# Altium project iot-vehicle-tracking-system-main.PrjPcb
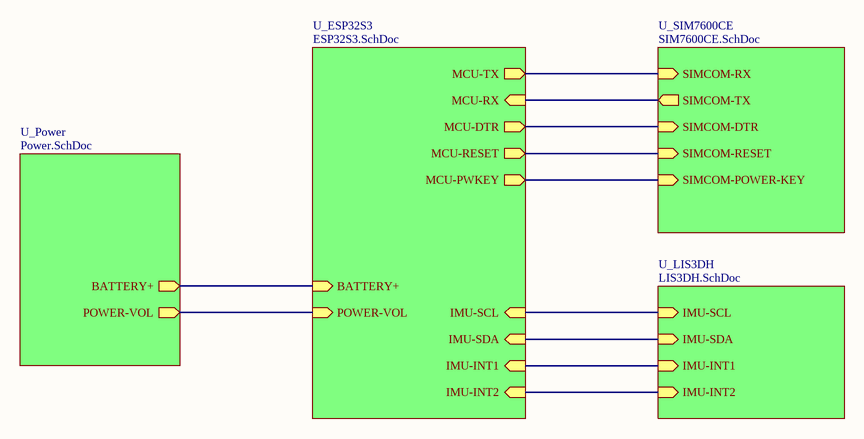
[diagram p0: Main-Schematic.SchDoc]
5 sheets, 174 parts. Net scope: hierarchical (ports join the sheet entries above them; power ports are global).
Board file: Main.PcbDoc
Sheets:
  Main-Schematic.SchDoc
    U_Power = Power.SchDoc
    U_ESP32S3 = ESP32S3.SchDoc
    U_SIM7600CE = SIM7600CE.SchDoc
    U_LIS3DH = LIS3DH.SchDoc

## Sheet Main-Schematic.SchDoc
size A; SheetNumber: 1; SheetTotal: 5

### Sub-sheets
U_ESP32S3 = ESP32S3.SchDoc: MCU-TX (out), MCU-RX (in), MCU-PWKEY (out), MCU-RESET (out), BATTERY+ (in), IMU-SCL (in), IMU-SDA (in), IMU-INT1 (in), IMU-INT2 (in), POWER-VOL (in), MCU-DTR (out)
U_LIS3DH = LIS3DH.SchDoc: IMU-SCL (in), IMU-SDA (in), IMU-INT1 (in), IMU-INT2 (in)
U_Power = Power.SchDoc: BATTERY+ (out), POWER-VOL (out)
U_SIM7600CE = SIM7600CE.SchDoc: SIMCOM-TX (out), SIMCOM-RX (in), SIMCOM-POWER-KEY (in), SIMCOM-RESET (in), SIMCOM-DTR (in)

### Nets
I2C0-SCL: sheet U_ESP32S3/IMU-SCL, sheet U_LIS3DH/IMU-SCL
I2C0-SDA: sheet U_ESP32S3/IMU-SDA, sheet U_LIS3DH/IMU-SDA
NetC54_1: sheet U_ESP32S3/MCU-RX, sheet U_SIM7600CE/SIMCOM-TX
NetQ1_3: sheet U_ESP32S3/MCU-DTR, sheet U_SIM7600CE/SIMCOM-DTR
NetQ2_3: sheet U_ESP32S3/MCU-TX, sheet U_SIM7600CE/SIMCOM-RX
NetR8_2: sheet U_Power/POWER-VOL, sheet U_ESP32S3/POWER-VOL
NetR10_2: sheet U_Power/BATTERY+, sheet U_ESP32S3/BATTERY+
NetR56_1: sheet U_ESP32S3/MCU-RESET, sheet U_SIM7600CE/SIMCOM-RESET
NetR57_1: sheet U_ESP32S3/MCU-PWKEY, sheet U_SIM7600CE/SIMCOM-POWER-KEY
NetU6_41: sheet U_ESP32S3/IMU-INT1, sheet U_LIS3DH/IMU-INT1
NetU6_42: sheet U_ESP32S3/IMU-INT2, sheet U_LIS3DH/IMU-INT2

## Sheet Power.SchDoc
size A3; SheetNumber: 2; SheetTotal: 5
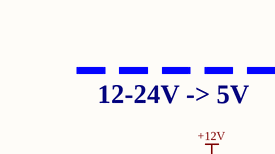
[diagram p1: Power.SchDoc, top left]
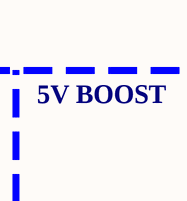
[diagram p2: Power.SchDoc, top right]
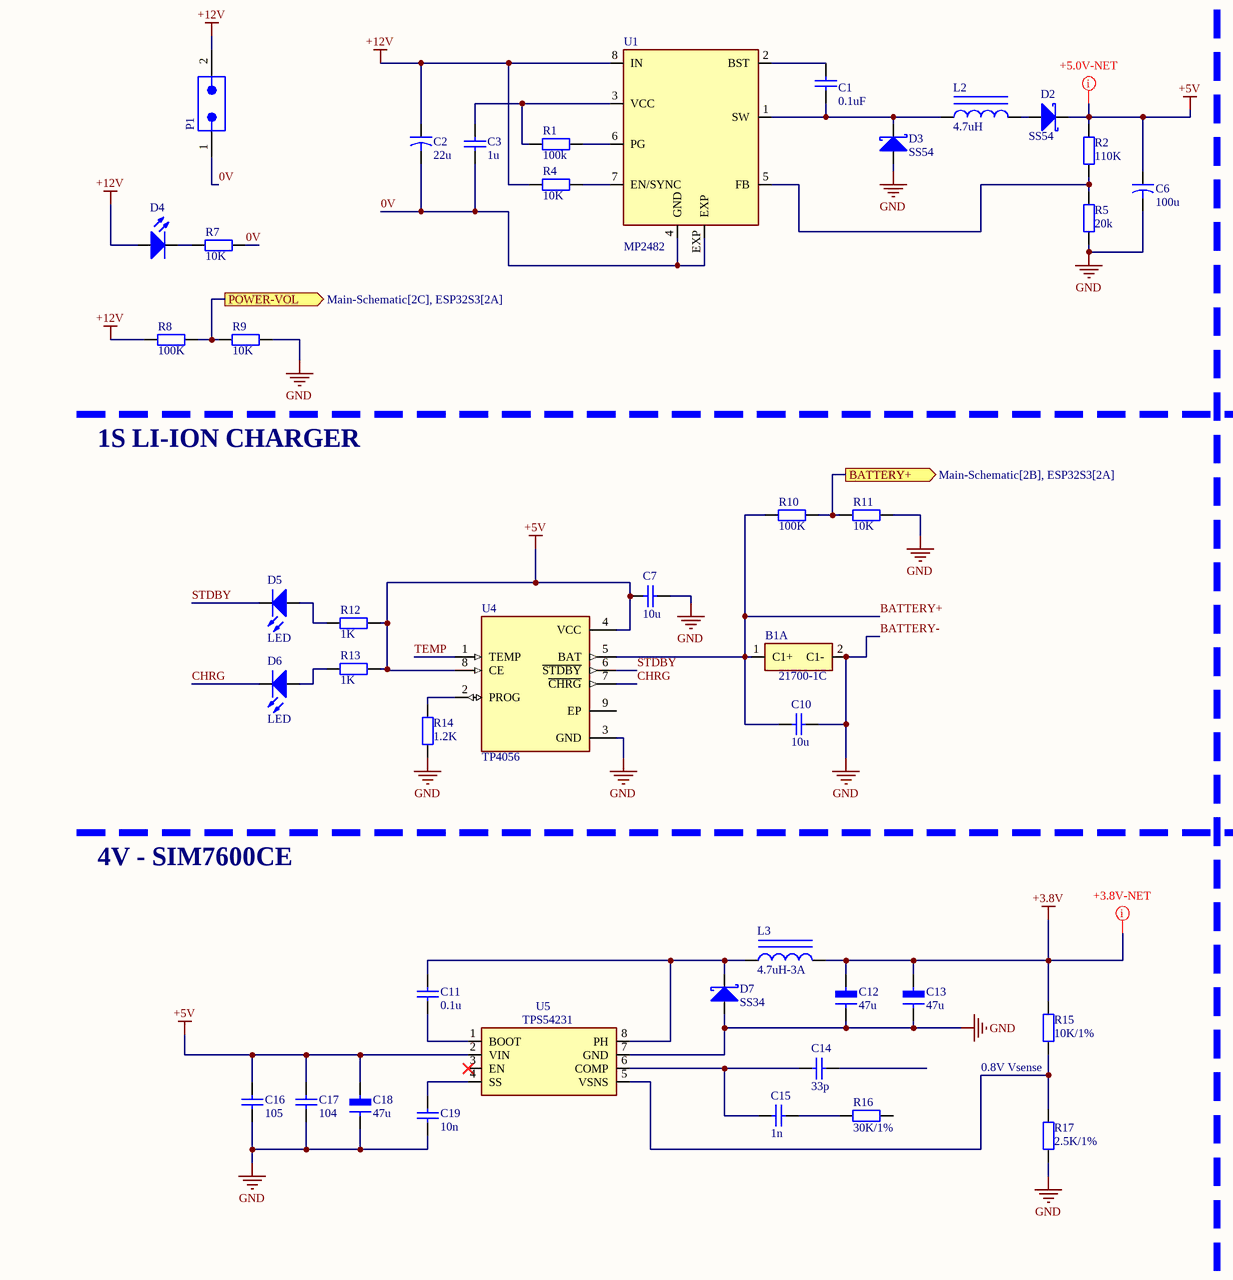
[diagram p3: Power.SchDoc, bottom left]
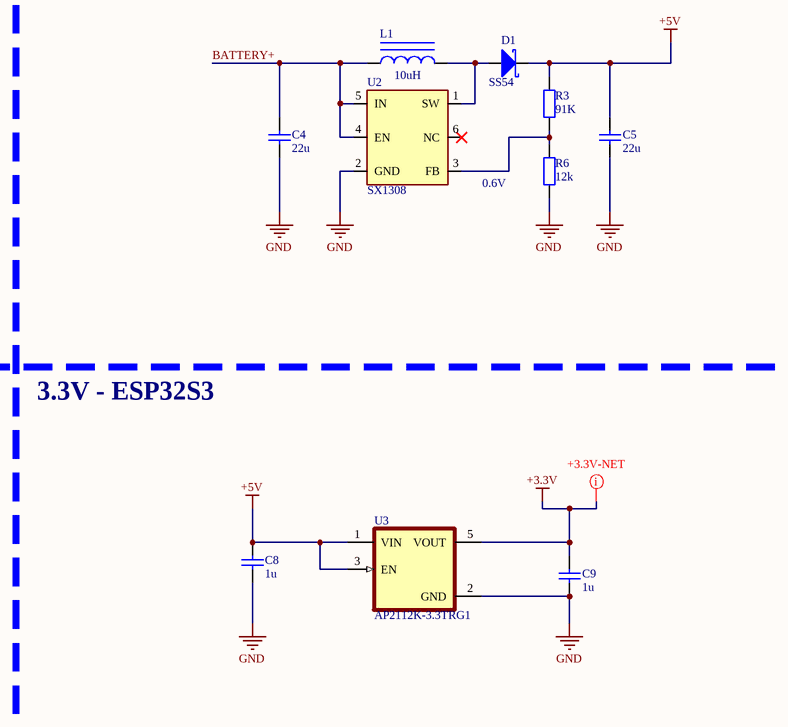
[diagram p4: Power.SchDoc, bottom right]

### Parts
B1  21700-1C  [18650-2C]  (part A of 2)
C1  0.1uF  [CAP_1206]
C2  22u  [ALU-SMD-CAP-D-6.3mm]
C3  1u  [CAP_0603]
C4  22u  [CAP_0603]
C5  22u  [CAP_0603]
C6  100u  [ALU-SMD-CAP-D-6.3mm]
C7  10u  [CAP_0603]
C8  1u  [CAP_0603]
C9  1u  [CAP_0603]
C10  10u  [CAP_0603]
C11  0.1u  [CAP_0603]
C12  47u  [C_Tanta_C6032]
C13  47u  [C_Tanta_C6032]
C14  33p  [CAP_0603]
C15  1n  [CAP_0603]
C16  105  [CAP_0603]
C17  104  [CAP_0603]
C18  47u  [C_Tanta_C6032]
C19  10n  [CAP_0603]
D1  SS54  [SMB]
D2  SS54  [SMB]
D3  SS54  [SMB]
D4  (no value)  [LED-0805-Red]
D5  LED  [LED-0805-Red]
D6  LED  [LED-0805-Red]
D7  SS34  [SMA]
L1  10uH  [CD75]
L2  4.7uH  [IND-0520]
L3  4.7uH-3A  [IND_CDRH127-4R7NC_SUM]
P1  64900229522  [64900229522]  (value not drawn)
R1  100k  [RES_0603]
R2  110K  [RES_0603]
R3  91K  [RES_0603]
R4  10K  [RES_0603]
R5  20k  [RES_0603]
R6  12k  [RES_0603]
R7  10K  [RES_0603]
R8  100K  [RES_0603]
R9  10K  [RES_0603]
R10  100K  [RES_0603]
R11  10K  [RES_0603]
R12  1K  [RES_0603]
R13  1K  [RES_0603]
R14  1.2K  [RES_0603]
R15  10K/1%  [RES_0603]
R16  30K/1%  [RES_0603]
R17  2.5K/1%  [RES_0603]
U1  MP2482  [SOP8-P]
U2  SX1308  [SOT23-6]
U3  AP2112K-3.3TRG1  [SOT95P285X140-5N]
U4  TP4056  [SOP127P600X175-9N]
U5  TPS54231  [SOIC8-1.75H]

### Ports
BATTERY+ (out, see Main-Schematic[2B], ESP32S3[2A]), POWER-VOL (out, see Main-Schematic[2C], ESP32S3[2A])

### Nets
+3.3V: C9.2 U3.5(VOUT)  [project net V-MCU]
+3.8V: C12.1 C13.1 L3.2 R15.2  [project net V-SIM]
+5V: C5.2 C6.1 C7.2 C8.2 C16.2 C17.2 C18.1 D1.2(K) D2.2(K) R2.2 R3.2 R12.2 R13.2 U3.1(VIN) U3.3(EN) U4.4(VCC) U4.8(CE) U5.2(VIN)
+12V: C2.1 D4.1(A) P1.2 R4.2 R8.1 U1.8(IN)
BATTERY-: B1.2(C1-) C4.1 C5.1 C6.2 C7.1 C8.1 C9.1 C10.1 C12.2 C13.2 C16.1 C17.1 C18.2 C19.1 D3.1(A) D7.1(A) R5.1 R6.1 R9.2 R11.2 R14.2 R17.1 U2.2(GND) U3.2(GND) U4.3(GND) U5.7(GND)  [also labelled GND]
0V: C2.2 C3.1 P1.1 R7.2 U1.4(GND) U1.EXP
BATTERY+: B1.1(C1+) C4.2 C10.2 L1.1 R10.1 U2.4(EN) U2.5(IN) U4.5(BAT)
CHRG: D6.2(K) U4.7(~{CHRG})
STDBY: D5.2(K) U4.6(~{STDBY})
TEMP: U4.1(TEMP)
NetC1_1: C1.1 U1.2(BST)
NetC1_2: C1.2 D3.2(K) L2.1 U1.1(SW)
NetC3_2: C3.2 R1.2 U1.3(VCC)
NetC11_1: C11.1 U5.1(BOOT)
NetC11_2: C11.2 D7.2(K) L3.1 U5.8(PH)
NetC14_2: C14.2 C15.2 U5.6(COMP)
NetC15_1: C15.1 R16.2
NetC19_2: C19.2 U5.4(SS)
NetD1_1: D1.1(A) L1.2 U2.1(SW)
NetD2_1: D2.1(A) L2.2
NetD4_2: D4.2(K) R7.1
NetD5_1: D5.1(A) R12.1
NetD6_1: D6.1(A) R13.1
NetR1_1: R1.1 U1.6(PG)
NetR2_1: R2.1 R5.2 U1.5(FB)
NetR3_1: R3.1 R6.2 U2.3(FB)
NetR4_1: R4.1 U1.7(EN/SYNC)
NetR8_2: R8.2 R9.1 ; port POWER-VOL
NetR10_2: R10.2 R11.1 ; port BATTERY+
NetR14_1: R14.1 U4.2(PROG)
NetR15_1: R15.1 R17.2 U5.5(VSNS)

Not connected (* = marked no-connect by the designer): C14 1; R16 1; U2 6(NC)*; U4 9(EP); U5 3(EN)*

### Layout directives
net class POWER: +5V, V-MCU, V-SIM

### Notes on the sheet
- 12-24V -> 5V
- 5V BOOST
- 0.6V
- 1S LI-ION CHARGER
- 3.3V - ESP32S3
- 4V - SIM7600CE
- (near R15) 0.8V Vsense

### Library data of the parts
B1 = 18650-2C
C1 C3-C5 C7-C11 C14-C17 C19 = Cap_NP: Non-polarized capacitor
C2 C6 = Cap_Alu: Polarized aluminum capacitor
C12 C13 C18 = Cap_Tatan: Polarized tantaLum capacitor
D1-D3 D7 = S-Diode: Schottky diode
D4-D6 = LED: Light Emitting Diode
L1-L3 = Inductor Iron: Magnetic-Core Inductor; Published: 24-Mar-1999; LatestRevisionDate: 17-Jul-2002; LatestRevisionNote: Re-released for DXP Platform.; PackageReference: AXIAL-0.9; Publisher: Altium Limited; PackageDescription: Axial Device, Thru-Hole; 2 Leads; 0.9 in Pin Spacing
P1 = 64900229522: WR-MPC4 THT Male Right Angled Header, pitch 4.2mm, 2p; Manufacturer: Wurth Elektronik; Contact Resistance: 10mOhm; Insulation Resistance: 1000MOhm; Rated Current: 9A; Working Voltage: 600VAC; Manufacturer Part Number: 64900229522; Category: Wire-to-Board Connectors; Match Code: WR-MPC4; ComponentLink1Description: Website Link; ComponentLink1URL: https://www.we-online.com/redexpert/article/64900229522?ad; ComponentLink2Description: Datasheet Link; ComponentLink2URL: https://www.we-online.com/redexpert/spec/64900229522?ad; Mount: Through Hole; Min Operating Temperature: -40°C; Max Operating Temperature: 105°C; Packaging: Tray; Gender: Male; Number of Pins: 2; Number of Rows: 2; Orientation: Right Angled; Pitch: 4.2mm
R1-R17 = Resistor
U1 = MP2482: 5A, 30V, 420kHz Step-Down Converter; MF: Monolithic Power Systems Inc.; SnapEDA_Link: https://www.snapeda.com/parts/MP2482/Monolithic+Power+Systems+Inc./view-part/?ref=snap; Package: None; Value: *; MP: MP2482; Check_prices: https://www.snapeda.com/parts/MP2482/Monolithic+Power+Systems+Inc./view-part/?ref=eda
U2 = SX1308: 1.2MHz 2A Step Up Converter 85T
U3 = AP2112K-3.3TRG1: Linear Voltage Regulator IC Positive Fixed 1 Output 600mA SOT-25; MF: Diodes Inc.; Value: *; Purchase-URL: https://pricing.snapeda.com/search/part/AP2112K-3.3TRG1/?ref=eda; Package: SOT-753 Diodes Inc.; Availability: In Stock; Check_prices: https://www.snapeda.com/parts/AP2112K-3.3TRG1/Diodes+Inc./view-part/?ref=eda; Price: None; SnapEDA_Link: https://www.snapeda.com/parts/AP2112K-3.3TRG1/Diodes+Inc./view-part/?ref=snap; MP: AP2112K-3.3TRG1
U4 = TP4056: Complete single cell Li-Ion battery with a constant current / constant voltage linear charger; MF: NanJing Top Power ASIC Corp.; Check_prices: https://www.snapeda.com/parts/TP4056/NanJing+Top+Power+ASIC+Corp./view-part/?ref=eda; SnapEDA_Link: https://www.snapeda.com/parts/TP4056/NanJing+Top+Power+ASIC+Corp./view-part/?ref=snap; Price: None; Availability: Not in stock; Package: Package; MP: TP4056; Value: *
U5 = TPS54231: 2-A, 28-V Input, Step-Down DC-DC Converter

## Sheet ESP32S3.SchDoc
size A3; SheetNumber: 3; SheetTotal: 5
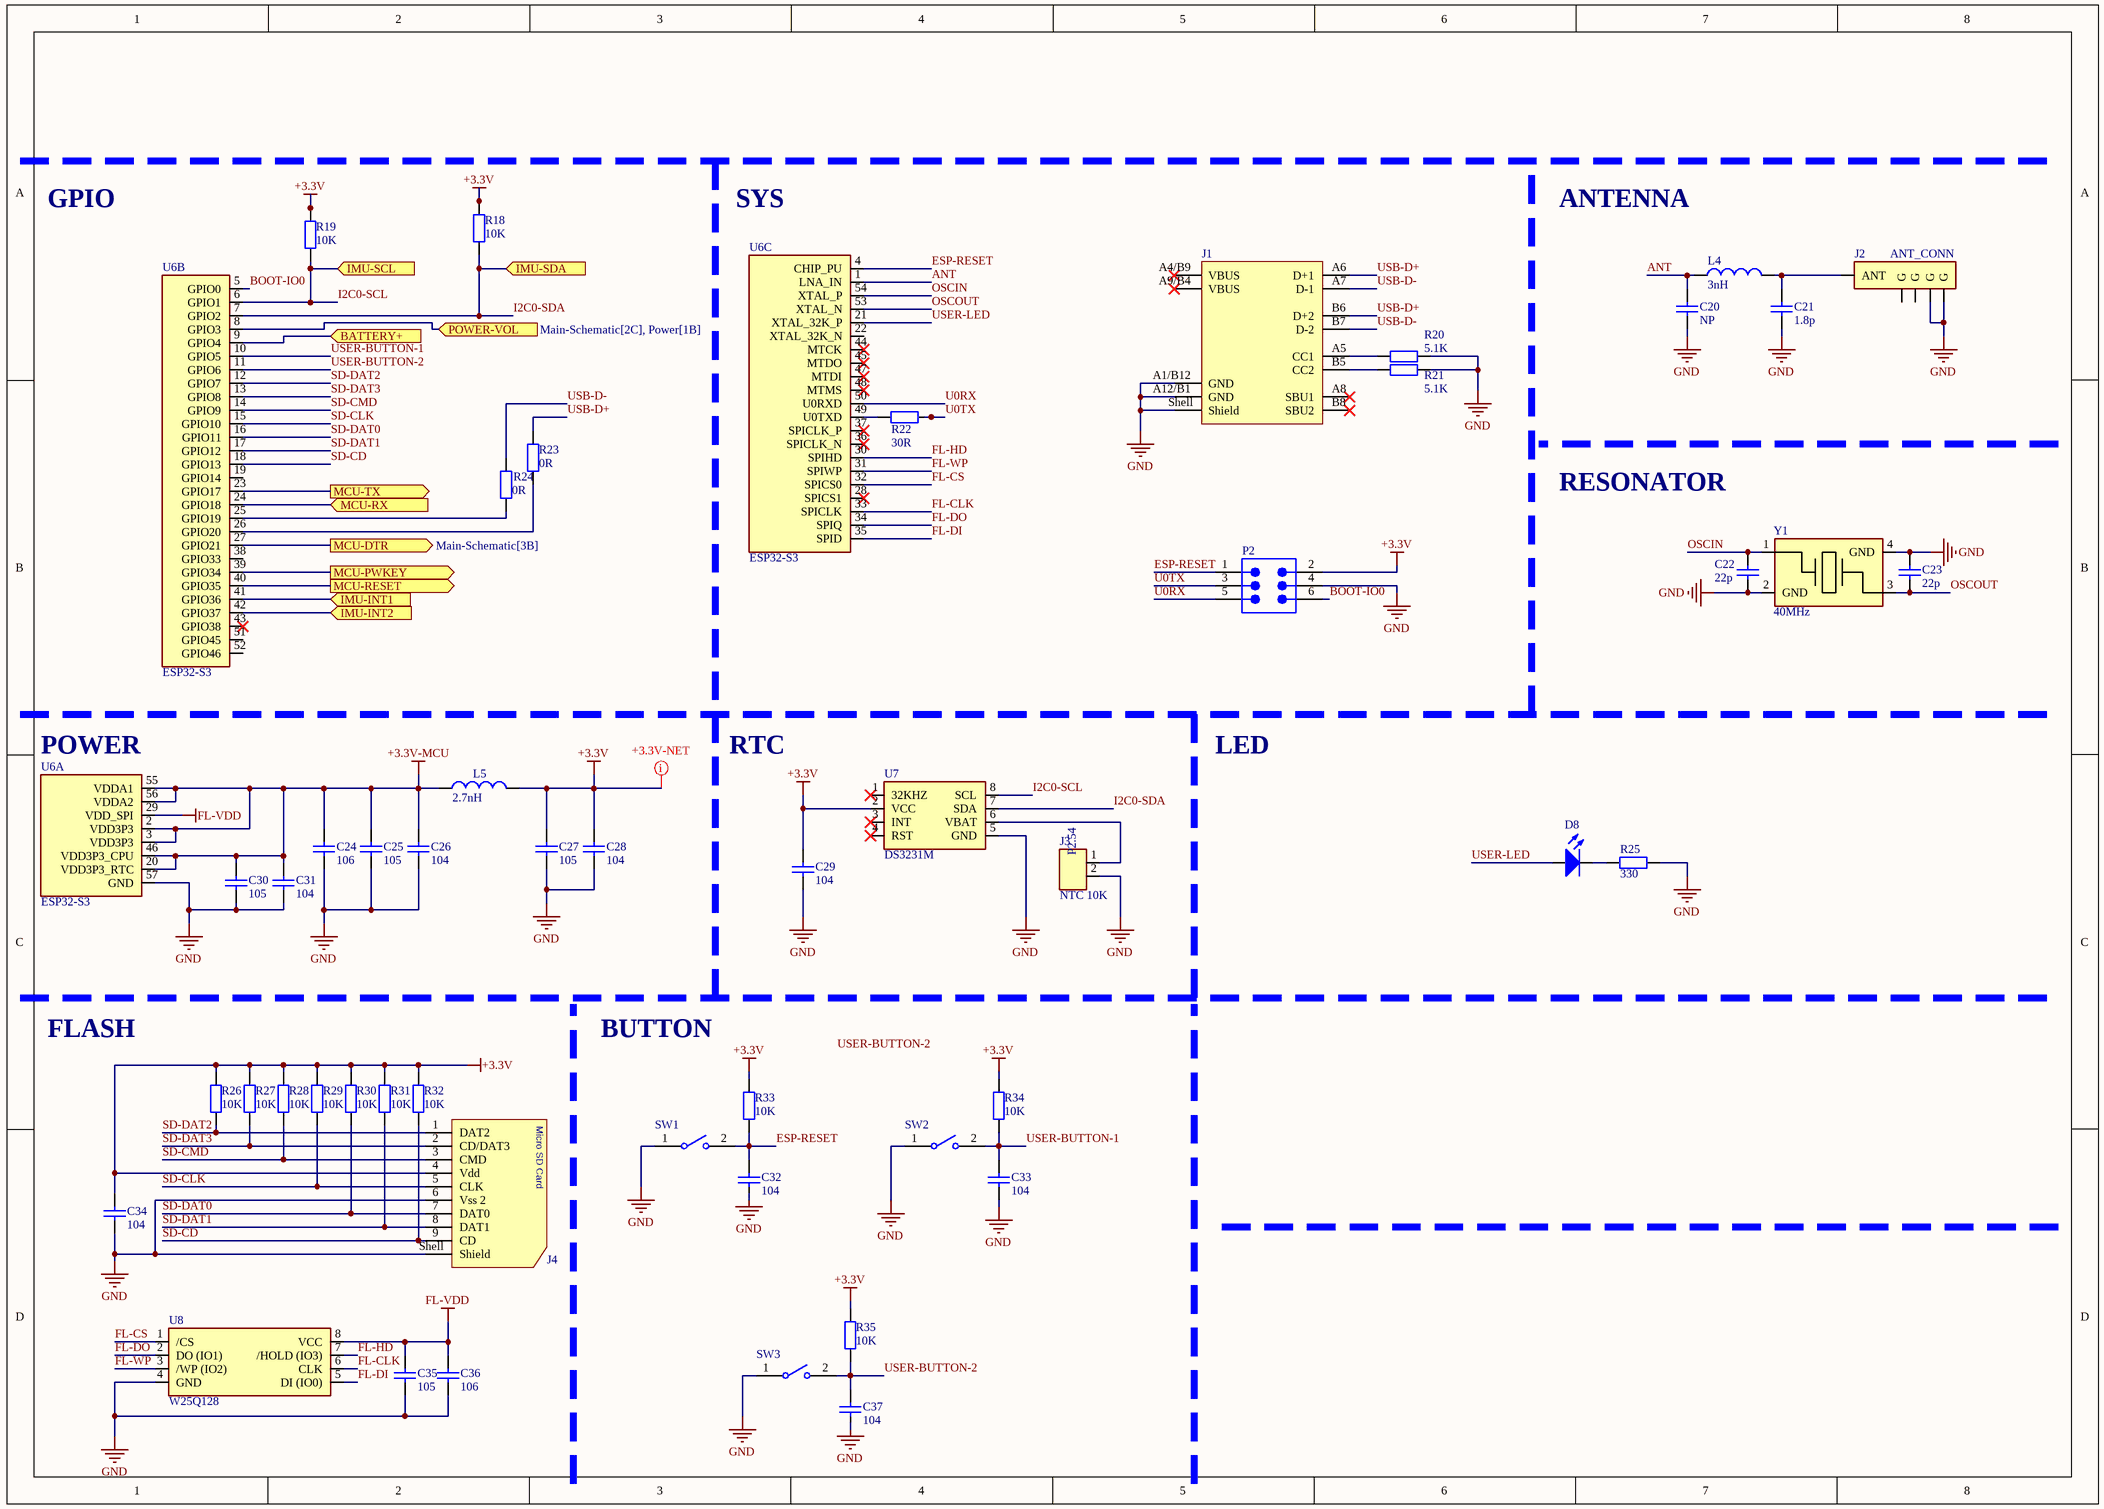
[diagram p5: ESP32S3.SchDoc]

### Parts
C20  NP  [CAP_0603]
C21  1.8p  [CAP_0603]
C22  22p  [CAP_0603]
C23  22p  [CAP_0603]
C24  106  [CAP_0603]
C25  105  [CAP_0603]
C26  104  [CAP_0603]
C27  105  [CAP_0603]
C28  104  [CAP_0603]
C29  104  [CAP_0603]
C30  105  [CAP_0603]
C31  104  [CAP_0603]
C32  104  [CAP_0603]
C33  104  [CAP_0603]
C34  104  [CAP_0603]
C35  105  [CAP_0603]
C36  106  [CAP_0603]
C37  104  [CAP_0603]
D8  (no value)  [LED-0805-Red]
J1  629722000214  [629722000214]  (value not drawn)
J2  ANT_CONN  [IPEX]
J3  NTC 10K  [XH2.54M-2]
J4  693071040911  [693071040911]  (value not drawn)
L4  3nH  [INDC-0805]
L5  2.7nH  [INDC-0805]
P2  61200621621  [61200621621]  (value not drawn)
R18  10K  [RES_0603]
R19  10K  [RES_0603]
R20  5.1K  [RES_0603]
R21  5.1K  [RES_0603]
R22  30R  [RES_0603]
R23  0R  [RES_0603]
R24  0R  [RES_0603]
R25  330  [RES_0603]
R26  10K  [RES_0603]
R27  10K  [RES_0603]
R28  10K  [RES_0603]
R29  10K  [RES_0603]
R30  10K  [RES_0603]
R31  10K  [RES_0603]
R32  10K  [RES_0603]
R33  10K  [RES_0603]
R34  10K  [RES_0603]
R35  10K  [RES_0603]
SW1  434121050816  [434121050816]  (value not drawn)
SW2  434121050816  [434121050816]  (value not drawn)
SW3  434121050816  [434121050816]  (value not drawn)
U6  ESP32-S3  [QFN56]  (parts A,B,C of 3)
U7  DS3231M  [SOP8-P1.27]
U8  W25Q128  [SOIC127P790X216-8N]
Y1  40MHz  [Y-3225]

### Ports
BATTERY+ (in, see Main-Schematic[2B], Power[4B]), IMU-INT1 (in, see Main-Schematic[3C], LIS3DH[3B]), IMU-INT2 (in, see Main-Schematic[3C], LIS3DH[3B]), IMU-SCL (in, see Main-Schematic[3C], LIS3DH[2C]), IMU-SDA (in, see Main-Schematic[3C], LIS3DH[2C]), MCU-DTR (out, see Main-Schematic[3B]), MCU-PWKEY (out, see Main-Schematic[3B]), MCU-RESET (out, see Main-Schematic[3B]), MCU-RX (in, see Main-Schematic[3B]), MCU-TX (out, see Main-Schematic[3B]), POWER-VOL (in, see Main-Schematic[2C], Power[1B])

### Nets
+3.3V: C27.2 C28.2 C29.1 C34.2 J4.4(Vdd) L5.2 P2.2 R18.2 R19.2 R26.2 R27.2 R28.2 R29.2 R30.2 R31.2 R32.2 R33.2 R34.2 R35.2 U7.2(VCC)  [project net V-MCU]
+3.3V-MCU: C24.2 C25.2 C26.2 C30.2 C31.2 L5.1 U6.2(VDD3P3) U6.3(VDD3P3) U6.20(VDD3P3_RTC) U6.46(VDD3P3_CPU) U6.55(VDDA1) U6.56(VDDA2)
FL-VDD: C35.2 C36.2 U6.29(VDD_SPI) U8.8(VCC)
GND: C20.1 C21.1 C22.1 C23.2 C24.1 C25.1 C26.1 C27.1 C28.1 C29.2 C30.1 C31.1 C32.2 C33.2 C34.1 C35.1 C36.1 C37.2 J1.A1/B12(GND) J1.A12/B1(GND) J1.Shell(Shield) J2.4(G) J2.5(G) J3.2 J4.6(Vss_2) J4.Shell(Shield) P2.4 R20.2 R21.2 R25.2 SW1.1 SW2.1 SW3.1 U6.57(GND) U7.5(GND) U8.4(GND) Y1.2(GND) Y1.4(GND)  [project net BATTERY-]
ANT: C20.2 L4.1 U6.1(LNA_IN)
BOOT-IO0: P2.6 U6.5(GPIO0)
ESP-RESET: C32.1 P2.1 R33.1 SW1.2 U6.4(CHIP_PU)
FL-CLK: U6.33(SPICLK) U8.6(CLK)
FL-CS: U6.32(SPICS0) U8.1(/CS)
FL-DI: U6.35(SPID) U8.5(DI_(IO0))
FL-DO: U6.34(SPIQ) U8.2(DO_(IO1))
FL-HD: U6.30(SPIHD) U8.7(/HOLD_(IO3))
FL-WP: U6.31(SPIWP) U8.3(/WP_(IO2))
I2C0-SCL: R19.1 U6.6(GPIO1) U7.8(SCL) ; port IMU-SCL
I2C0-SDA: R18.1 U6.7(GPIO2) U7.7(SDA) ; port IMU-SDA
OSCIN: C22.2 U6.54(XTAL_P) Y1.1(OSCIN)
OSCOUT: C23.1 U6.53(XTAL_N) Y1.3(OSCOUT)
SD-CD: J4.9(CD) R32.1 U6.18(GPIO13)
SD-CLK: J4.5(CLK) R29.1 U6.15(GPIO10)
SD-CMD: J4.3(CMD) R28.1 U6.14(GPIO9)
SD-DAT0: J4.7(DAT0) R30.1 U6.16(GPIO11)
SD-DAT1: J4.8(DAT1) R31.1 U6.17(GPIO12)
SD-DAT2: J4.1(DAT2) R26.1 U6.12(GPIO7)
SD-DAT3: J4.2(CD/DAT3) R27.1 U6.13(GPIO8)
U0RX: P2.5 U6.50(U0RXD)
U0TX: P2.3 R22.2
USB-D+: J1.A6(D+1) J1.B6(D+2) R23.2
USB-D-: J1.A7(D-1) J1.B7(D-2) R24.2
USER-BUTTON-1: C33.1 R34.1 SW2.2 U6.10(GPIO5)
USER-BUTTON-2: C37.1 R35.1 SW3.2 U6.11(GPIO6)
USER-LED: D8.1(A) U6.21(XTAL_32K_P)
NetC21_2: C21.2 J2.1(ANT) L4.2
NetC54_1: U6.24(GPIO18) ; port MCU-RX
NetD8_2: D8.2(K) R25.1
NetJ1_A5: J1.A5(CC1) R20.1
NetJ1_B5: J1.B5(CC2) R21.1
NetJ3_1: J3.1 U7.6(VBAT)
NetQ1_3: U6.27(GPIO21) ; port MCU-DTR
NetQ2_3: U6.23(GPIO17) ; port MCU-TX
NetR8_2: U6.8(GPIO3) ; port POWER-VOL
NetR10_2: U6.9(GPIO4) ; port BATTERY+
NetR22_1: R22.1 U6.49(U0TXD)
NetR23_1: R23.1 U6.26(GPIO20)
NetR24_1: R24.1 U6.25(GPIO19)
NetR56_1: U6.40(GPIO35) ; port MCU-RESET
NetR57_1: U6.39(GPIO34) ; port MCU-PWKEY
NetU6_41: U6.41(GPIO36) ; port IMU-INT1
NetU6_42: U6.42(GPIO37) ; port IMU-INT2

Not connected (* = marked no-connect by the designer): J1 A4/B9(VBUS)* A8(SBU1)* A9/B4(VBUS)* B8(SBU2)*; J2 2(G) 3(G); U6 19(GPIO14) 22(XTAL_32K_N) 28(SPICS1)* 36(SPICLK_N)* 37(SPICLK_P)* 38(GPIO33) 43(GPIO38)* 44(MTCK)* 45(MTDO)* 47(MTDI)* 48(MTMS)* 51(GPIO45) 52(GPIO46); U7 1(32KHZ)* 3(INT)* 4(RST)*

### Layout directives
net class POWER: V-MCU

### Notes on the sheet
- GPIO
- SYS
- ANTENNA
- RESONATOR
- (near U6) POWER
- RTC
- LED
- FLASH
- BUTTON
- Labels drawn without touching a wire or pin: USER-BUTTON-2
- (in symbol Conn_Cai_2P_2.54) P2.54

### Library data of the parts
C20-C37 = Cap_NP: Non-polarized capacitor
D8 = LED: Light Emitting Diode
J1 = 629722000214: WR-COM USB 2.0 Type C Receptacle Horizontal SMT; Manufacturer: Wurth Elektronik; Match Code: WR-USB; Interface Type: Type C; Number of Ports: 1; Rated Current: 5; Working Voltage: 48V (DC); Manufacturer Part Number: 629722000214; Category: Input/Output Connector; ComponentLink1Description: Website Link; ComponentLink1URL: https://www.we-online.com/redexpert/article/629722000214?ad; ComponentLink2Description: Datasheet Link; ComponentLink2URL: https://www.we-online.com/redexpert/spec/629722000214?ad; Mount: Surface Mount; Min Operating Temperature: -40°C; Max Operating Temperature: 85°C; Packaging: Tape and Reel; Application: USB 2.0; Gender: Receptacle; Number of Pins: 16; Orientation: Horizontal
J2 = ANT_CONN: ATENNA PIN 1
J3 = Conn_Cai_2P_2.54
J4 = 693071040911: WR-CRD SD Card Connector Push & Push Socket, 9 pins; Manufacturer: Wurth Elektronik; Durability: 10000 Mating cycles; Manufacturer Part Number: 693071040911; Category: Input/Output Connector; Match Code: WR-CRD; ComponentLink1Description: Website Link; ComponentLink1URL: https://www.we-online.com/redexpert/article/693071040911?ad; ComponentLink2Description: Datasheet Link; ComponentLink2URL: https://www.we-online.com/redexpert/spec/693071040911?ad; Mount: Surface Mount; Min Operating Temperature: -25 °C; Max Operating Temperature: 85 °C; Packaging: Tape and Reel; Application: Micro SD Card; Gender: Socket; Number of Pins: 9; Type: Push & Push
L4 L5 = Inductor: Code_IEC: 1005; Published: 8-Jun-2000; LatestRevisionDate: 29-May-2009; LatestRevisionNote: IPC-7351 Footprint Added.; PackageReference: 0402-A; Publisher: Altium Limited; PackageDescription: Chip Inductor; Code_JEITA: 0402
P2 = 61200621621: WR-BHD Male Box Header, THT Straight, pitch 2.54 mm, 2 Rows, 6 Pins; Manufacturer: Wurth Elektronik; Contact Resistance: 20 mΩ; Insulation Resistance: 1000 MΩ; Pitch: 2.54 mm; Rated Current: 3 A; Working Voltage: 250 V; Withstanding Voltage: 500 V; Manufacturer Part Number: 61200621621; Category: Wire-to-Board Connector; Match Code: WR-BHD; ComponentLink1Description: Website Link; ComponentLink1URL: https://www.we-online.com/redexpert/article/61200621621?ad; ComponentLink2Description: Datasheet Link; ComponentLink2URL: https://www.we-online.com/redexpert/spec/61200621621?ad; Mount: Through Hole; Min Operating Temperature: -40 °C; Max Operating Temperature: 105 °C; Packaging: Tray; Length: 15.28 mm; Width: 9.1 mm; Height: 9.1 mm; Gender: Male; Number of Pins: 6; Number of Rows: 2; Orientation: Straight
R18-R35 = Resistor
SW1-SW3 = 434121050816: WS-TASV SMT Tact Switch, 6mm x 3.5mm, 160gf, SPST-NO, 12V, 50mA; Manufacturer: Wurth Elektronik; Washable: No; Manufacturer Part Number: 434121050816; Category: Tact Switch; Match Code: WS-TASV; ComponentLink1Description: Website Link; ComponentLink1URL: https://www.we-online.com/redexpert/article/434121050816?ad; ComponentLink2Description: Datasheet Link; ComponentLink2URL: https://www.we-online.com/redexpert/spec/434121050816?ad; Mount: Surface Mount; Min Operating Temperature: -40°C; Max Operating Temperature: 85°C; Packaging: Tape and Reel; Length: 6mm; Width: 3.5mm; Height: 5mm; Circuit: SPST-NO; Contact Material: Stainless Steel; Contact Plating: Silver; Operation Force: 160gf; Rated Current: 50mA; Rated Voltage (DC): 12V; Terminal Material: Copper Alloy; Terminal Plating: Silver
U7 = DS3231M: I2C realtime clock (RTC)
U8 = W25Q256JV: 256M-bit (32MB) Serial Flash memory
Y1 = Resonator

## Sheet SIM7600CE.SchDoc
size A3; SheetNumber: 4; SheetTotal: 5
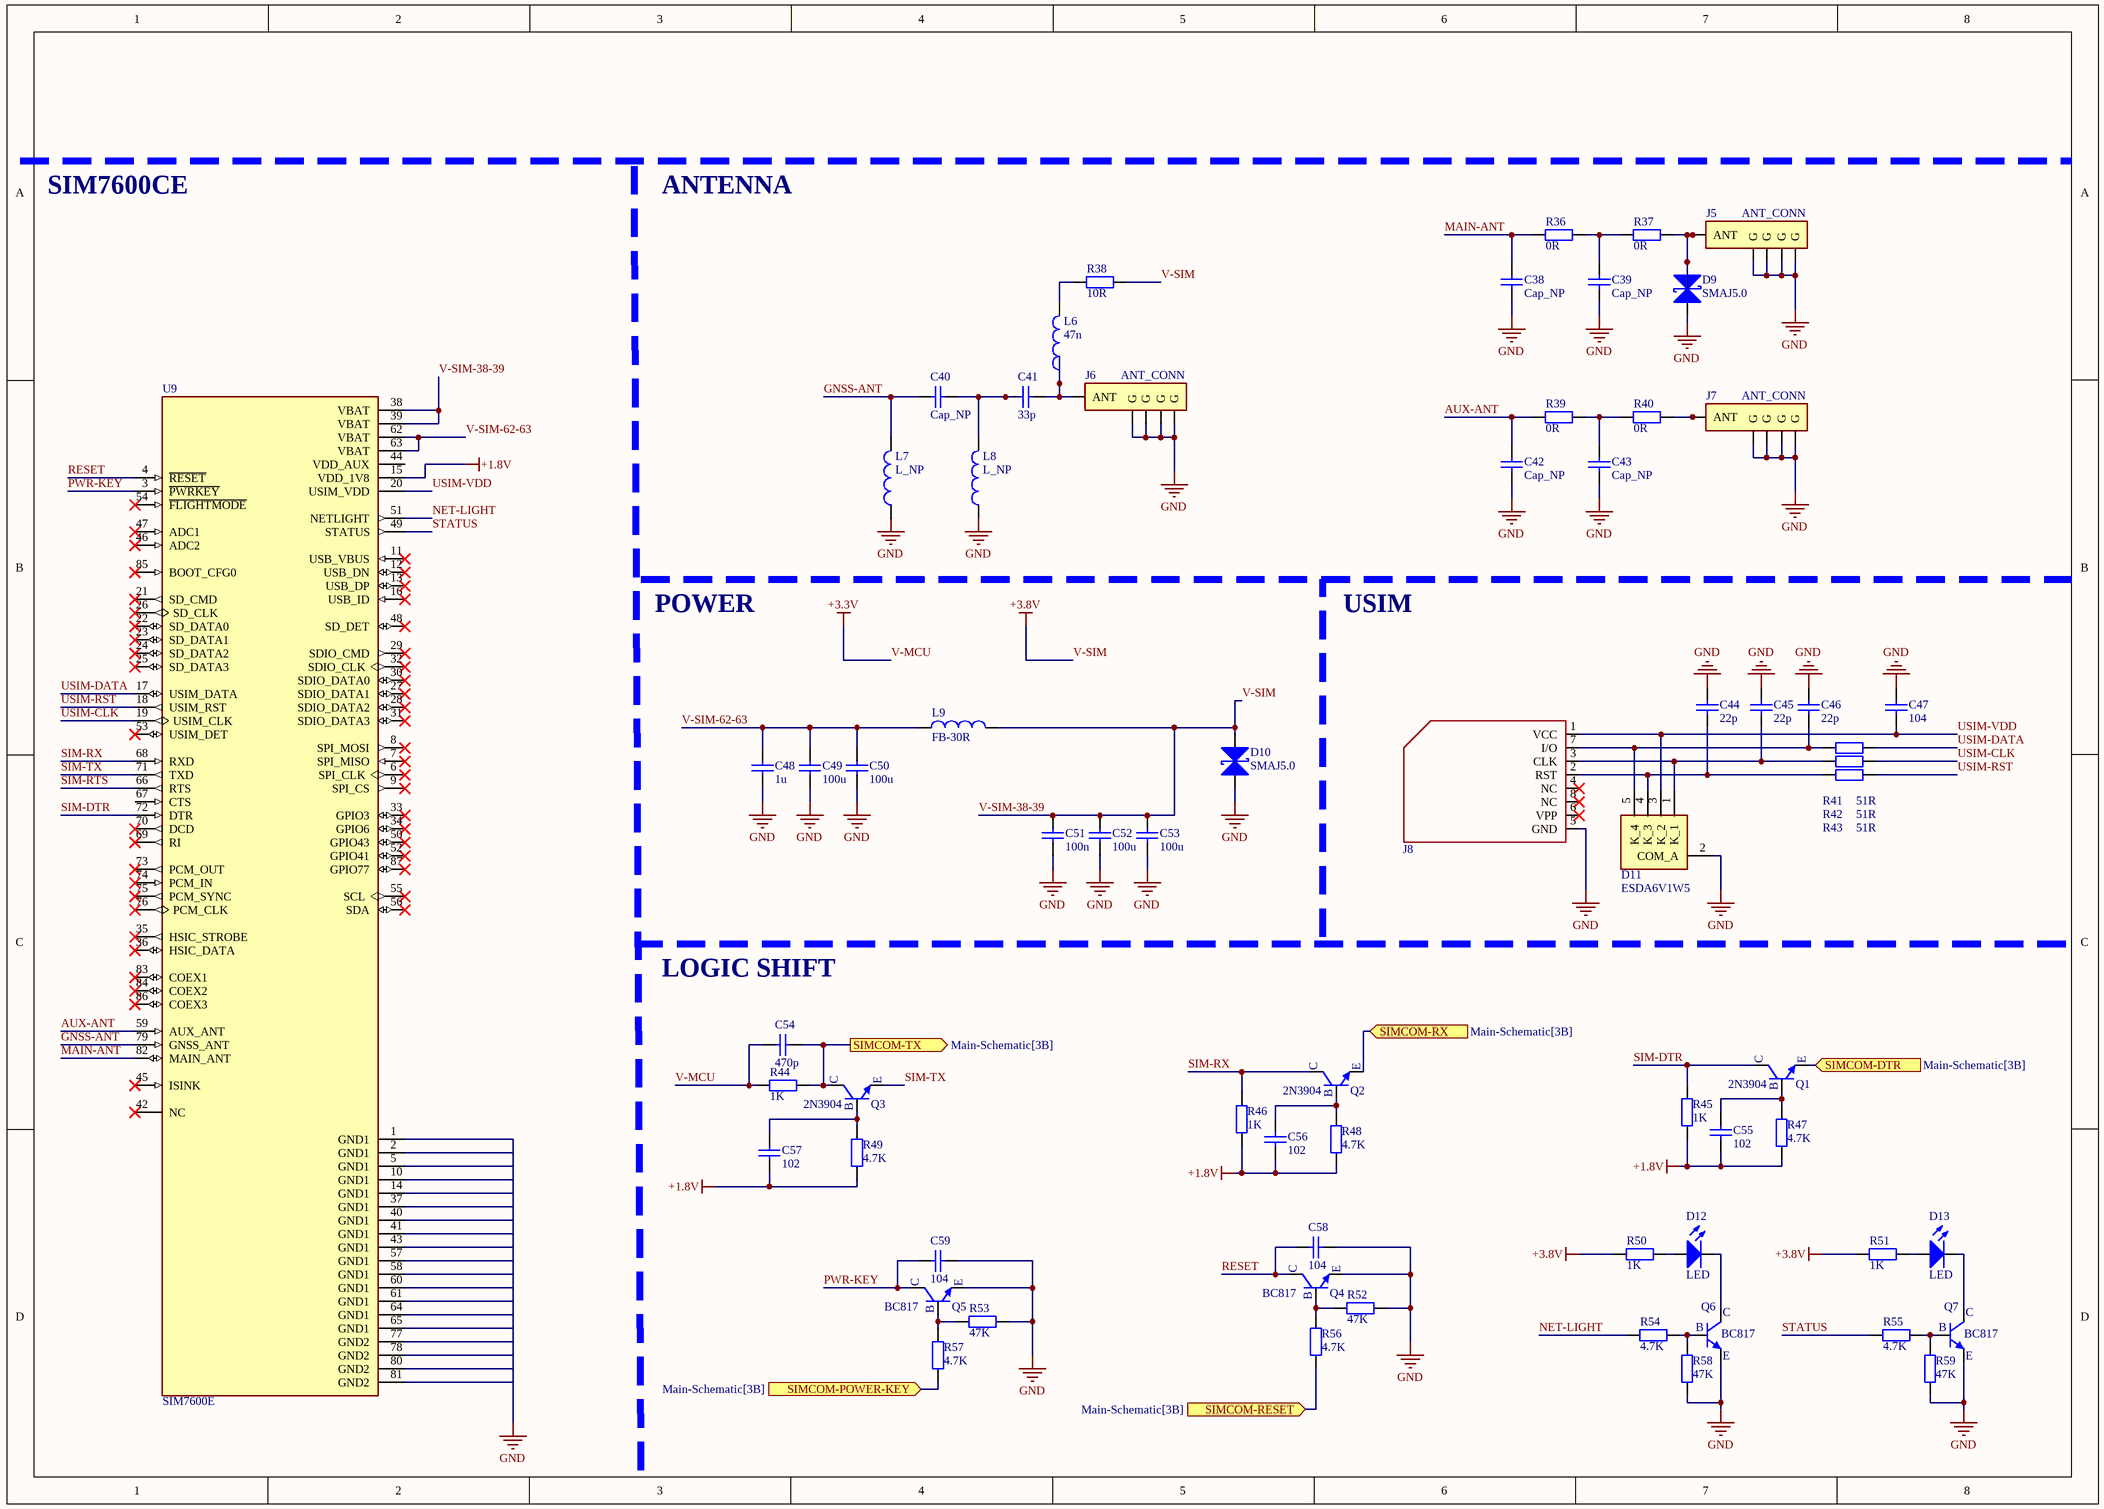
[diagram p6: SIM7600CE.SchDoc]

### Parts
C38  Cap_NP  [CAP_0603]
C39  Cap_NP  [CAP_0603]
C40  Cap_NP  [CAP_0603]
C41  33p  [CAP_0603]
C42  Cap_NP  [CAP_0603]
C43  Cap_NP  [CAP_0603]
C44  22p  [CAP_0603]
C45  22p  [CAP_0603]
C46  22p  [CAP_0603]
C47  104  [CAP_0603]
C48  1u  [CAP_0603]
C49  100u  [C_Tanta_B3528]
C50  100u  [C_Tanta_B3528]
C51  100n  [CAP_0603]
C52  100u  [C_Tanta_B3528]
C53  100u  [C_Tanta_B3528]
C54  470p  [CAP_0603]
C55  102  [CAP_0603]
C56  102  [CAP_0603]
C57  102  [CAP_0603]
C58  104  [CAP_0603]
C59  104  [CAP_0603]
D9  SMAJ5.0  [SMA]
D10  SMAJ5.0  [SMA]
D11  ESDA6V1W5  [SOT65P210X110-5N]
D12  LED  [LED-0805-Red]
D13  LED  [LED-0805-Red]
J5  ANT_CONN  [IPEX]
J6  ANT_CONN  [IPEX]
J7  ANT_CONN  [IPEX]
J8  MicroSimcard  [MICRO SIM SOCKET]  (value not drawn)
L6  47n  [INDC-0805]
L7  L_NP  [INDC-0805]
L8  L_NP  [INDC-0805]
L9  FB-30R  [INDC-0805]
Q1  2N3904  [SOT-23]
Q2  2N3904  [SOT-23]
Q3  2N3904  [SOT-23]
Q4  BC817  [SOT-23]
Q5  BC817  [SOT-23]
Q6  BC817  [SOT-23]
Q7  BC817  [SOT-23]
R36  0R  [RES_0603]
R37  0R  [RES_0603]
R38  10R  [RES_0603]
R39  0R  [RES_0603]
R40  0R  [RES_0603]
R41  51R  [RES_0603]
R42  51R  [RES_0603]
R43  51R  [RES_0603]
R44  1K  [RES_0603]
R45  1K  [RES_0603]
R46  1K  [RES_0603]
R47  4.7K  [RES_0603]
R48  4.7K  [RES_0603]
R49  4.7K  [RES_0603]
R50  1K  [RES_0603]
R51  1K  [RES_0603]
R52  47K  [RES_0603]
R53  47K  [RES_0603]
R54  4.7K  [RES_0603]
R55  4.7K  [RES_0603]
R56  4.7K  [RES_0603]
R57  4.7K  [RES_0603]
R58  47K  [RES_0603]
R59  47K  [RES_0603]
U9  SIM7600E  [XCVR_SIM7600E]

### Ports
SIMCOM-DTR (in, see Main-Schematic[3B]), SIMCOM-POWER-KEY (in, see Main-Schematic[3B]), SIMCOM-RESET (in, see Main-Schematic[3B]), SIMCOM-RX (in, see Main-Schematic[3B]), SIMCOM-TX (out, see Main-Schematic[3B])

### Nets
+1.8V: C55.1 C56.1 C57.1 R45.1 R46.1 R47.1 R48.1 R49.1 U9.15(VDD_1V8)
GND: C38.1 C39.1 C42.1 C43.1 C44.2 C45.2 C46.2 C47.2 C48.1 C49.1 C50.1 C51.1 C52.1 C53.1 C58.2 C59.2 D9.1(K) D10.1(K) D11.2(COM_A) J5.2(G) J5.3(G) J5.4(G) J5.5(G) J6.2(G) J6.3(G) J6.4(G) J6.5(G) J7.2(G) J7.3(G) J7.4(G) J7.5(G) J8.5(GND) L7.1 L8.1 Q4.3(E) Q5.3(E) Q6.3(E) Q7.3(E) R52.2 R53.2 R58.1 R59.1  [project net BATTERY-]
V-MCU: C54.2 R44.2  [also labelled +3.3V]
V-SIM: C51.2 C52.2 C53.2 D10.2(A) L9.2 R38.1 R50.2 R51.2 U9.38(VBAT) U9.39(VBAT)  [also labelled +3.8V, V-SIM-38-39]
AUX-ANT: C42.2 R39.1 U9.59(AUX_ANT)
GNSS-ANT: C40.2 L7.2 U9.79(GNSS_ANT)
MAIN-ANT: C38.2 R36.1 U9.82(MAIN_ANT)
NET-LIGHT: R54.2 U9.51(NETLIGHT)
PWR-KEY: C59.1 Q5.2(C) U9.3(~{PWRKEY})
RESET: C58.1 Q4.2(C) U9.4(~{RESET})
SIM-DTR: Q1.2(C) R45.2 U9.72(DTR)
SIM-RTS: U9.66(RTS)
SIM-RX: Q2.2(C) R46.2 U9.68(RXD)
SIM-TX: Q3.3(E) U9.71(TXD)
STATUS: R55.2 U9.49(STATUS)
USIM-CLK: R42.2 U9.19(USIM_CLK)
USIM-DATA: R41.2 U9.17(USIM_DATA)
USIM-RST: R43.2 U9.18(USIM_RST)
USIM-VDD: C47.1 D11.3(K_2) J8.1(VCC) U9.20(USIM_VDD)
V-SIM-62-63: C48.2 C49.2 C50.2 L9.1 U9.62(VBAT) U9.63(VBAT)
NetC39_2: C39.2 R36.2 R37.1
NetC40_1: C40.1 C41.2 L8.2
NetC41_1: C41.1 J6.1(ANT) L6.1
NetC43_2: C43.2 R39.2 R40.1
NetC44_1: C44.1 D11.4(K_3) J8.2(RST) R43.1
NetC45_1: C45.1 D11.1(K_1) J8.3(CLK) R42.1
NetC46_1: C46.1 D11.5(K_4) J8.7(I/O) R41.1
NetC54_1: C54.1 Q3.2(C) R44.1 ; port SIMCOM-TX
NetC55_2: C55.2 Q1.1(B) R47.2
NetC56_2: C56.2 Q2.1(B) R48.2
NetC57_2: C57.2 Q3.1(B) R49.2
NetD9_2: D9.2(A) J5.1(ANT) R37.2
NetD12_1: D12.1(A) R50.1
NetD12_2: D12.2(K) Q6.2(C)
NetD13_1: D13.1(A) R51.1
NetD13_2: D13.2(K) Q7.2(C)
NetJ7_1: J7.1(ANT) R40.2
NetL6_2: L6.2 R38.2
NetQ1_3: Q1.3(E) ; port SIMCOM-DTR
NetQ2_3: Q2.3(E) ; port SIMCOM-RX
NetQ4_1: Q4.1(B) R52.1 R56.2
NetQ5_1: Q5.1(B) R53.1 R57.2
NetQ6_1: Q6.1(B) R54.1 R58.2
NetQ7_1: Q7.1(B) R55.1 R59.2
NetR56_1: R56.1 ; port SIMCOM-RESET
NetR57_1: R57.1 ; port SIMCOM-POWER-KEY

Not connected (* = marked no-connect by the designer): J8 4(NC)* 6(VPP)* 8(NC)*; U9 1(GND1) 2(GND1) 5(GND1) 6(SPI_CLK)* 7(SPI_MISO)* 8(SPI_MOSI)* 9(SPI_CS)* 10(GND1) 11(USB_VBUS)* 12(USB_DN)* 13(USB_DP)* 14(GND1) 16(USB_ID)* 21(SD_CMD)* 22(SD_DATA0)* 23(SD_DATA1)* 24(SD_DATA2)* 25(SD_DATA3)* 26(SD_CLK)* 27(SDIO_DATA1)* 28(SDIO_DATA2)* 29(SDIO_CMD)* 30(SDIO_DATA0)* 31(SDIO_DATA3)* 32(SDIO_CLK)* 33(GPIO3)* 34(GPIO6)* 35(HSIC_STROBE)* 36(HSIC_DATA)* 37(GND1) 40(GND1) 41(GND1) 42(NC)* 43(GND1) 44(VDD_AUX) 45(ISINK)* 46(ADC2)* 47(ADC1)* 48(SD_DET)* 50(GPIO43)* 52(GPIO41)* 53(USIM_DET)* 54(~{FLIGHTMODE})* 55(SCL)* 56(SDA)* 57(GND1) 58(GND1) 60(GND1) 61(GND1) 64(GND1) 65(GND1) 67(CTS) 69(RI)* 70(DCD)* 73(PCM_OUT)* 74(PCM_IN)* 75(PCM_SYNC)* 76(PCM_CLK)* 77(GND2) 78(GND2) 80(GND2) 81(GND2) 83(COEX1)* 84(COEX2)* 85(BOOT_CFG0)* 86(COEX3)* 87(GPIO77)*

### Notes on the sheet
- SIM7600CE
- ANTENNA
- POWER
- USIM
- LOGIC SHIFT
- Labels drawn without touching a wire or pin: GND

### Library data of the parts
C38-C59 = Cap_NP: Non-polarized capacitor
D9 D10 = TVS-Diode: TVS diode
D11 = ESDA6V1W5: Integrated Circuit; Manufacturer_Name: STMicroelectronics; Datasheet Link: http://www.st.com/st-web-ui/static/active/en/resource/technical/document/datasheet/CD00064033.pdf; Height: 1.1mm; Manufacturer_Part_Number: ESDA6V1W5; Mouser Part Number: 511-ESDA6V1W5; Mouser Price/Stock: https://www.mouser.co.uk/ProductDetail/STMicroelectronics/ESDA6V1W5?qs=9NrABl3fj%2FrhT5vdkOmqXg%3D%3D; Arrow Part Number: ESDA6V1W5; Arrow Price/Stock: https://www.arrow.com/en/products/esda6v1w5/stmicroelectronics?utm_currency=USD&region=nac
D12 D13 = LED: Light Emitting Diode
J5-J7 = ANT_CONN: ATENNA PIN 1
J8 = MicroSimcard: Micro Simcard Socket
L6-L9 = Inductor: Code_IEC: 1005; Published: 8-Jun-2000; LatestRevisionDate: 29-May-2009; LatestRevisionNote: IPC-7351 Footprint Added.; PackageReference: 0402-A; Publisher: Altium Limited; PackageDescription: Chip Inductor; Code_JEITA: 0402
Q1-Q7 = N-Trans
R36-R59 = Resistor
U9 = SIM7600E: LTE-FDD/LTE-TDD/HSPA+/UMTS/EDGE/GPRS/GSM Module On Module 10Mbps 800MHz/850MHz/900MHz/1800MHz/2100MHz/2300MHz/2500MHz/2600MHz 3.4V to 4.2V 24dBm; MF: SIMCom Wireless Solutions Limited; SnapEDA_Link: https://www.snapeda.com/parts/SIM7600E/SIMCom/view-part/?ref=snap; Package: SMD-87 SIMCom; Value: *; MP: SIM7600E; Check_prices: https://www.snapeda.com/parts/SIM7600E/SIMCom/view-part/?ref=eda

## Sheet LIS3DH.SchDoc
size A3; SheetNumber: 5; SheetTotal: 5
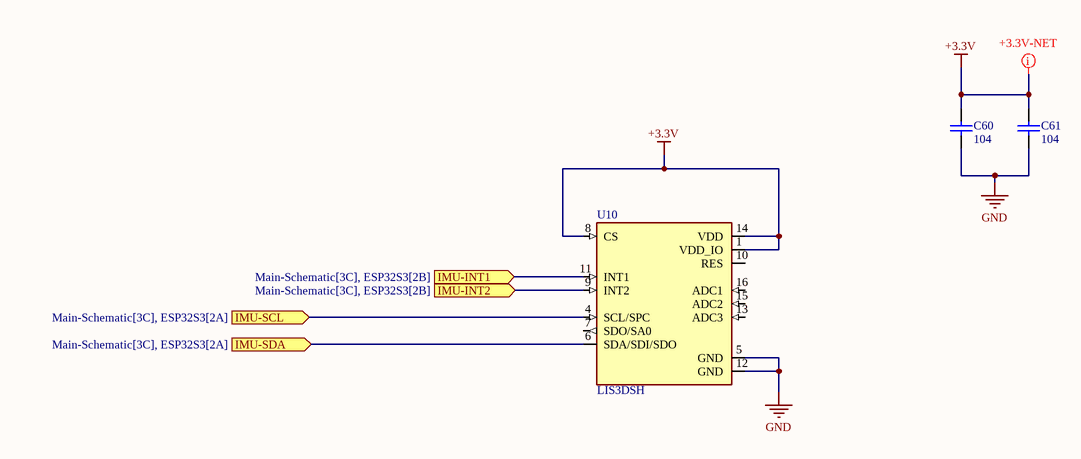
[diagram p7: LIS3DH.SchDoc]

### Parts
C60  104  [CAP_0603]
C61  104  [CAP_0603]
U10  LIS3DSH  [LGA16R50P5X3_300X300X100N]

### Ports
IMU-INT1 (in, see Main-Schematic[3C], ESP32S3[2B]), IMU-INT2 (in, see Main-Schematic[3C], ESP32S3[2B]), IMU-SCL (in, see Main-Schematic[3C], ESP32S3[2A]), IMU-SDA (in, see Main-Schematic[3C], ESP32S3[2A])

### Nets
+3.3V: C60.2 C61.2 U10.1(VDD_IO) U10.8(CS) U10.14(VDD)  [project net V-MCU]
GND: C60.1 C61.1 U10.5(GND) U10.12(GND)  [project net BATTERY-]
I2C0-SCL: U10.4(SCL/SPC) ; port IMU-SCL
I2C0-SDA: U10.6(SDA/SDI/SDO) ; port IMU-SDA
NetU6_41: U10.11(INT1) ; port IMU-INT1
NetU6_42: U10.9(INT2) ; port IMU-INT2

Not connected (* = marked no-connect by the designer): U10 7(SDO/SA0) 10(RES) 13(ADC3) 15(ADC2) 16(ADC1)

### Layout directives
net class POWER: V-MCU

### Library data of the parts
C60 C61 = Cap_NP: Non-polarized capacitor
U10 = LIS3DSH: Accelerometer X, Y, Z Axis Â±2g, 4g, 6g, 8g, 16g 1.56Hz ~ 800Hz 16-LGA _3x3_; MF: STMicroelectronics; Availability: Unavailable; Value: *; Package: LGA-16 STMicroelectronics; Price: None; SnapEDA_Link: https://www.snapeda.com/parts/LIS3DSH/STMicroelectronics/view-part/422648/?ref=snap; MP: LIS3DSH

## Nets that join several sheets
BATTERY-: Power (26 pins), ESP32S3 (38 pins), SIM7600CE (42 pins), LIS3DH (C60.1 C61.1 U10.5 U10.12)
V-MCU: Power (C9.2 U3.5), ESP32S3 (20 pins), SIM7600CE (C54.2 R44.2), LIS3DH (5 pins)
V-SIM: Power (C12.1 C13.1 L3.2 R15.2), SIM7600CE (10 pins)
I2C0-SCL: ESP32S3 (R19.1 U6.6 U7.8), LIS3DH (U10.4)
I2C0-SDA: ESP32S3 (R18.1 U6.7 U7.7), LIS3DH (U10.6)
NetC54_1: ESP32S3 (U6.24), SIM7600CE (C54.1 Q3.2 R44.1)
NetQ1_3: ESP32S3 (U6.27), SIM7600CE (Q1.3)
NetQ2_3: ESP32S3 (U6.23), SIM7600CE (Q2.3)
NetR8_2: Power (R8.2 R9.1), ESP32S3 (U6.8)
NetR10_2: Power (R10.2 R11.1), ESP32S3 (U6.9)
NetR56_1: ESP32S3 (U6.40), SIM7600CE (R56.1)
NetR57_1: ESP32S3 (U6.39), SIM7600CE (R57.1)
NetU6_41: ESP32S3 (U6.41), LIS3DH (U10.11)
NetU6_42: ESP32S3 (U6.42), LIS3DH (U10.9)